# Altium schematic sheet ZBT Radio.SchDoc
size A; SheetNumber: 1; SheetTotal: 6
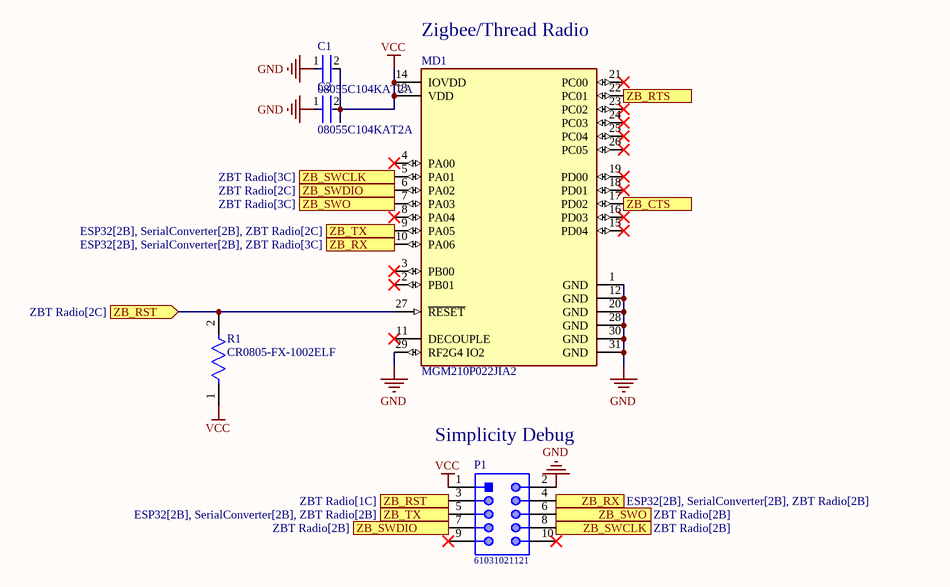
[diagram p0: ZBT Radio.SchDoc]

## Parts
C1  08055C104KAT2A  [FP-0805-L_2_01_0_2-W_1_25-IPC_C]
C2  08055C104KAT2A  [FP-0805-L_2_01_0_2-W_1_25-IPC_C]
MD1  MGM210P022JIA2  [FP-MGM210P022JIA2-MFG]
P1  61031021121  [61031021121]
R1  CR0805-FX-1002ELF  [FP-CR0805-IPC_A]

## Ports
ZB_CTS, ZB_RST (in, see ZBT Radio[1C]), ZB_RST (in, see ZBT Radio[2C]), ZB_RTS, ZB_RX (in, see ESP32[2B], SerialConverter[2B], ZBT Radio[3C]), ZB_RX (out, see ESP32[2B], SerialConverter[2B], ZBT Radio[2B]), ZB_SWCLK (see ZBT Radio[2B]), ZB_SWCLK (see ZBT Radio[3C]), ZB_SWDIO (see ZBT Radio[2B]), ZB_SWDIO (see ZBT Radio[2C]), ZB_SWO (see ZBT Radio[2B]), ZB_SWO (see ZBT Radio[3C]), ZB_TX (in, see ESP32[2B], SerialConverter[2B], ZBT Radio[2B]), ZB_TX (out, see ESP32[2B], SerialConverter[2B], ZBT Radio[2C])

## Nets
GND: C1.1 C2.1 MD1.1(GND) MD1.12(GND) MD1.20(GND) MD1.28(GND) MD1.29(RF2G4_IO2) MD1.30(GND) MD1.31(GND) P1.2
VCC: C1.2 C2.2 MD1.13(VDD) MD1.14(IOVDD) P1.1 R1.1
ZB_CTS: MD1.17(PD02) ; port ZB_CTS
ZB_RST: MD1.27(~{RESET}) P1.3 R1.2 ; port ZB_RST
ZB_RTS: MD1.22(PC01) ; port ZB_RTS
ZB_RX: MD1.10(PA06) P1.4 ; port ZB_RX
ZB_SWCLK: MD1.5(PA01) P1.8 ; port ZB_SWCLK
ZB_SWDIO: MD1.6(PA02) P1.7 ; port ZB_SWDIO
ZB_SWO: MD1.7(PA03) P1.6 ; port ZB_SWO
ZB_TX: MD1.9(PA05) P1.5 ; port ZB_TX

Not connected (* = marked no-connect by the designer): MD1 2(PB01)* 3(PB00)* 4(PA00)* 8(PA04)* 11(DECOUPLE)* 15(PD04)* 16(PD03)* 18(PD01)* 19(PD00)* 21(PC00)* 23(PC02)* 24(PC03)* 25(PC04)* 26(PC05)*; P1 9* 10*

## Notes on the sheet
- (near MD1) Zigbee/Thread Radio
- (near P1) Simplicity Debug

## Library data of the parts
C1 C2 = CMP-2000-05016-2: General Purpose Ceramic Capacitor, 0805, 100nF, 10%, X7R, 0.15, 50V; Dissipation Factor: 2.5%; Insulation Resistance: 100GR; Voltage Rating (DC): 50V; Package Quantity: 4000; Tolerance: 10%; Voltage Rating: 50V; Dielectric: X7R; Case/Package: 0805; Lead Free: Lead Free; Dielectric Material: Ceramic; Thickness: 0.037inch; Weight: 0.001411oz; Max Operating Temperature: 125°C; REACH SVHC: No SVHC; Mount: Surface Mount; RoHS Compliant: Yes; Depth: 1.25mm; Height: 0.5mm; Case Code (Metric): 2012; Length: 2mm; Termination: Standard; Case Code (Imperial): 0805; Number of Pins: 2; Voltage: 50V; Radiation Hardening: No; Min Operating Temperature: -55°C; Capacitance: 100nF; Width: 1.2mm; Series: MLCC X7R; Packaging: Cut Tape
MD1 = CMP-08140-000019-1: RX TXRX MOD BLUETOOTH CHIP SMD
P1 = CMP-1502-01053-1: SMT Vertical Pin Header WR-PHD, Pitch 2.54 mm, Dual Row, 10 pins; Manufacturer: Wurth Elektronik; Gender: Male; Rated Current: 3A; Working Voltage: 250VAC; Withstanding Voltage: 500VAC; Pitch: 2.54mm; Pin Number: 10; Contact Resistance: 20mOhm; Packaging: TapeandReel; Part Number: 61031021121; Mounting Technology: SMT; Package Reference: 61031021121; Operating Temperature: -40to125degC; Manufacturer URL: http://www.we-online.de; Publisher: WurthElektronik; Datasheet URL: https://katalog.we-online.de/em/datasheet/6103xx21121.pdf; Orientation: Vertical; Row Number: Dual
R1 = CMP-07231-003204-1: Thick Film Chip Resistors 0805 10kΩ 0.125W 1% 100ppm/°C; Max Power Dissipation: 125mW; Voltage Rating: 150V; Voltage Rating (DC): 100V; Resistance: 10kR; Height: 0.5mm; Tolerance: 1%; Max Operating Temperature: 155°C; Thickness: 508um; Radiation Hardening: No; Packaging: Tape and Reel; Depth: 1.25mm; Contact Plating: Tin; Package Quantity: 1; Case Code (Metric): 2012; REACH SVHC: No SVHC; Min Operating Temperature: -55°C; Power Rating: 125mW; Mount: Surface Mount; Length: 2mm; Case Code (Imperial): 0805; Width: 1.25mm; Temperature Coefficient: 100ppm/°C; Termination: SMD/SMT; Composition: Thick Film; Features: Moisture Resistant; Case/Package: 0805; Number of Terminations: 2